# EAGLE design TinLi (EAGLE 6.2)
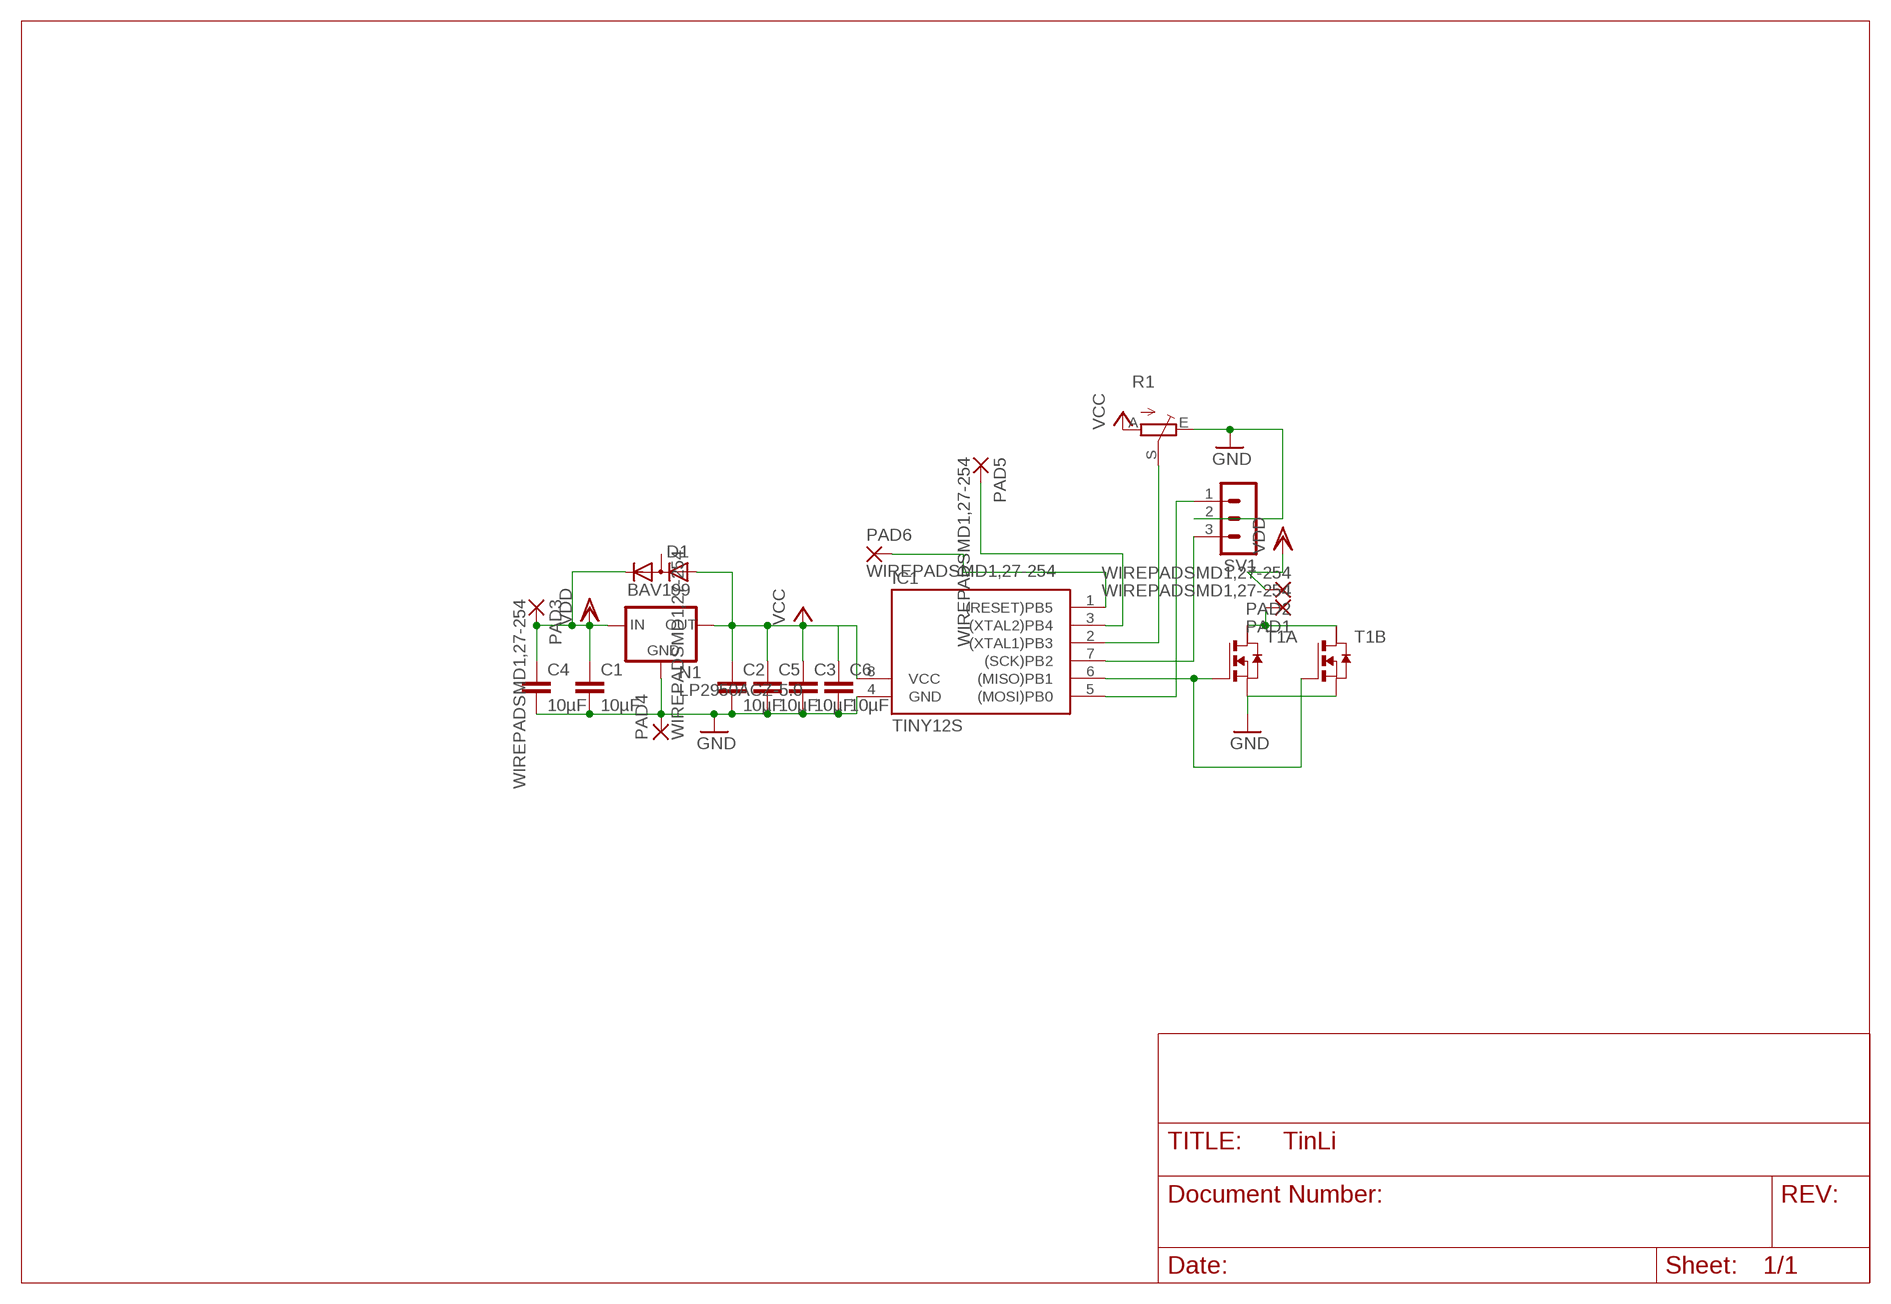
[diagram p0: schematic, sheet 1]

## Parts
C1  10µF  C-EUC1206  [C1206]
C2  10µF  C-EUC1206  [C1206]
C3  10µF  C-EUC1206  [C1206]
C4  10µF  C-EUC1206  [C1206]
C5  10µF  C-EUC1206  [C1206]
C6  10µF  C-EUC1206  [C1206]
D1  BAV199  [SOT23]
IC1  TINY12S  [SOIC8]
N1  LP2950ACZ-5.0  [TO92]
PAD1  WIREPADSMD1,27-254  [SMD1,27-2,54]
PAD2  WIREPADSMD1,27-254  [SMD1,27-2,54]
PAD3  WIREPADSMD1,27-254  [SMD1,27-2,54]
PAD4  WIREPADSMD1,27-254  [SMD1,27-2,54]
PAD5  WIREPADSMD1,27-254  [SMD1,27-2,54]
PAD6  WIREPADSMD1,27-254  [SMD1,27-2,54]
R1  TRIM_EU-CA6V  [CA6V]
SV1  MA03-1  [MA03-1]
T1  NMOS2SO8  [SO8]

## Nets
GND: C1.2 C2.2 C3.2 C4.2 C5.2 C6.2 IC1.4(GND) N1.2(GND) PAD4.1(P) R1.E SV1.2 T1.1(A:S) T1.3(B:S)
N$1: IC1.1((RESET)PB5) PAD6.1(P)
N$2: PAD1.1(P) T1.6(B:D) T1.8(A:D)
N$3: IC1.3((XTAL2)PB4) PAD5.1(P)
N$4: IC1.6((MISO)PB1) T1.2(A:G) T1.4(B:G)
N$7: IC1.7((SCK)PB2) SV1.3
N$8: IC1.5((MOSI)PB0) SV1.1
N$9: IC1.2((XTAL1)PB3) R1.S
VCC: C2.1 C3.1 C5.1 C6.1 D1.1(A) IC1.8(VCC) N1.1(OUT) R1.A
VDD: C1.1 C4.1 D1.2(C) N1.3(IN) PAD2.1(P) PAD3.1(P)
Unconnected: D1.3(AC) T1.5(B:D2) T1.7(A:D2)

## Library data of the parts
C1-C6 = rcl:C-EU: CAPACITOR, European symbol
D1 = diode:BAV199: DIODE low-leakage double diode
IC1 = atmel:TINY12*: MICROCONTROLLER 1 Kbytes FLASH 64 bytes EEPROM; OC_FARNELL: unknown; OC_NEWARK: unknown
N1 = v-reg:LP2950?*: Source: http://cache.national.com/ds/LP/LP2950.pdf
PAD1-PAD6 = wirepad:WIREPAD: Wire PAD connect wire on PCB
R1 = pot:TRIM_EU-: POTENTIOMETER
SV1 = con-lstb:MA03-1: PIN HEADER; OC_FARNELL: unknown; OC_NEWARK: unknown
T1 = zetex:NMOS2: Dual MOS FET; OC_FARNELL: unknown; OC_NEWARK: unknown

## Board
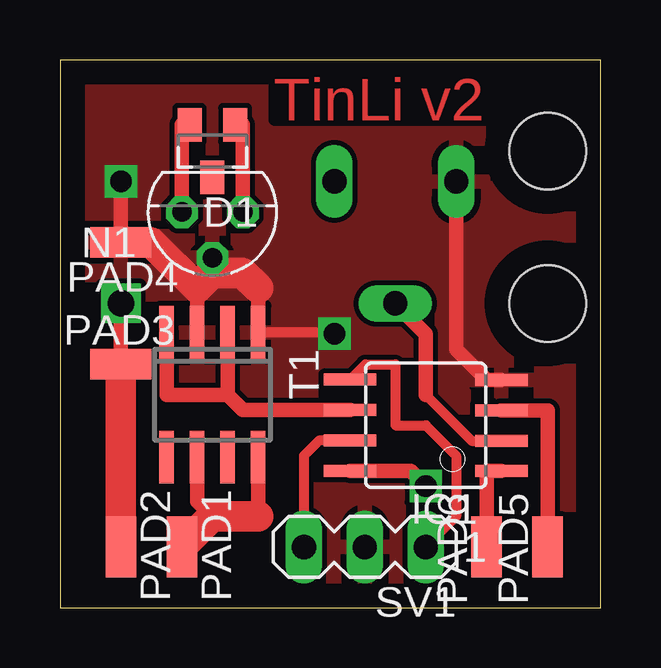
[diagram p1: board, top side]
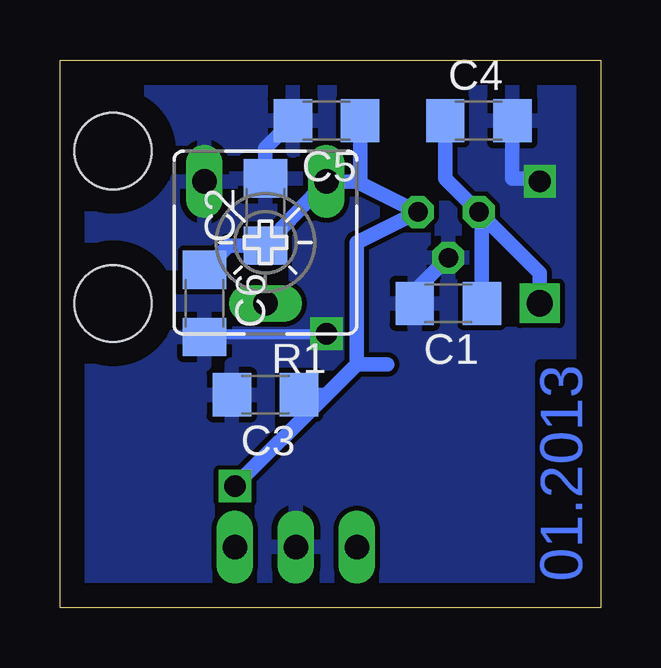
[diagram p2: board, bottom side, seen from below]

Size 22.53 x 22.85 mm. Coordinates in mm from the lower left corner, seen from the top.
Outline: 0,0 22.53,0 22.53,22.85 0,22.85 0,0
Copper layers (1*16): Top 0.035mm / dielectric 1.5mm / Bottom 0.035mm
Design rules: minimum track width 10mil, minimum drill 24mil, track to track 8mil, track to pad 8mil, pad to pad 8mil, via to via 8mil, smd to smd 8mil, copper to edge 40mil, drill to drill 8mil, minimum pad ring 10mil, minimum via ring 8mil, stop-mask expansion 4mil, vias tented up to drill 0mil, thermal gap 10mil
Holes 3.2 mm at 20.32,19.05 20.32,12.7

### Footprints (pad centres in the part's own frame; a part is rotated, then mirrored left to right if it is on the bottom)
C1206 = smd 1.6 x 1.8: 1 -1.4,0; 2 1.4,0
SOT23 = smd 1 x 1.4: 1 -0.95,-1.1; 2 0.95,-1.1; 3 0,1.1
SOIC8 = smd 0.5 x 2.2: 1 -1.905,-3.154; 2 -0.645,-3.154; 3 0.625,-3.154; 4 1.895,-3.154; 5 1.905,3.154; 6 0.635,3.154; 7 -0.635,3.154; 8 -1.905,3.154
TO92 = drill 0.813 octagon: 1 -1.27,0; 2 0,1.905; 3 1.27,0
SMD1,27-2,54 = smd 1.27 x 2.54: 1 0,0
CA6V = drill 1.016 long: A -2.54,-2.54; E 2.54,-2.54; S 0,2.54
MA03-1 = drill 1.016 long: 1 -2.54,0; 2 0,0; 3 2.54,0
SO8 = smd 0.6 x 2.2: 1 -1.905,-2.6; 2 -0.635,-2.6; 3 0.635,-2.6; 4 1.905,-2.6; 5 1.905,2.6; 6 0.635,2.6; 7 -0.635,2.6; 8 -1.905,2.6

### Placement (x,y rotation side)
C1  6.35,12.7 180 bottom
C2  13.97,16.51 90 bottom
C3  13.97,8.89 180 bottom
C4  5.08,20.32 0 bottom
C5  11.43,20.32 180 bottom
C6  16.51,12.7 270 bottom
D1  6.35,19.05 180 top
IC1  15.24,7.62 90 top
N1  6.35,16.51 180 top
PAD1  5.08,2.54 180 top
PAD2  2.54,2.54 180 top
PAD3  2.54,10.16 270 top
PAD4  2.54,15.24 90 top
PAD5  20.32,2.54 0 top
PAD6  17.78,2.54 0 top
R1  13.97,15.24 180 bottom
SV1  12.7,2.54 180 top
T1  6.35,8.89 180 top

### Tracks (layer width: path | path; a pad name or v marks a point on that pad's centre or on a via)
GND  (via drill 0.9)
  Top 0.406: v11.43,11.43 11.37,11.49 T1.1
  Top 0.61: IC1.4 17.78,9.52 16.51,10.79 R1.E | T1.3 5.71,13.34 | 8.26,13.34 T1.1 | v2.54,17.78 PAD4.1
  Top 1.27: PAD4.1 3.81,15.24 5.71,13.34 6.35,13.97 | 6.35,13.97 N1.2 | 8.26,13.34 7.62,13.97 6.35,13.97
  Bottom 0.406: C6.2 16.38,11.43 v11.43,11.43
  Bottom 0.61: C1.2 7.75,13.21 N1.2 | C4.2 3.68,17.91 2.67,17.91 v2.54,17.78 | C5.2 13.97,19.18 C2.2
  pour Top: 1.27,21.59 21.59,21.59 21.59,1.27 1.27,1.27
  pour Bottom: 1.27,21.59 21.59,21.59 21.59,1.27 1.27,1.27
N$1
  Top 0.61: IC1.1 17.78,5.71 PAD6.1
N$2
  Top 0.61: T1.6 5.71,4.45 6.35,3.81 | T1.8 8.26,3.81
  Top 1.27: PAD1.1 6.35,3.81 8.26,3.81
N$3
  Top 0.61: PAD5.1 20.32,8.24 IC1.3
N$4
  Top 0.61: T1.2 6.99,8.89 | 6.99,8.89 4.45,8.89 T1.4 | 6.99,8.89 7.62,8.26 IC1.6
N$7
  Top 0.406: IC1.7 10.79,6.99 10.16,6.35 SV1.3
N$8
  Top 0.406: IC1.5 12.72,10.16 13.97,10.16 13.97,7.62 15.24,7.62 16.51,6.35 16.51,3.81 SV1.1
N$9
  Top 0.406: 15.24,8.89 17.16,6.97 IC1.2
  Top 0.61: R1.S 15.24,11.43 15.24,8.89
VCC  (via drill 0.9)
  Top 0.61: IC1.8 14.61,5.71 v15.24,5.08 | D1.1 7.62,20.15 N1.1
  Bottom 0.61: 10.16,17.78 N1.1 10.16,15.24 10.16,10.16 | 10.16,17.78 R1.A C2.1 15.5,15.11 C6.1 | v15.24,5.08 11.43,8.89 | 11.43,8.89 10.16,10.16 | 10.16,10.16 8.89,10.16 | C5.1 10.03,17.78 10.16,17.78 | C3.1 11.43,8.89
VDD  (via drill 1.1)
  Top 0.61: PAD3.1 v2.54,12.7 | D1.2 5.08,20.15 N1.3
  Top 1.27: PAD3.1 PAD2.1
  Bottom 0.61: C1.1 4.95,16.38 N1.3 | v2.54,12.7 2.54,13.97 N1.3 | C4.1 6.48,17.91 N1.3

### Text on the board
Top: TinLi v2
Bottom: 01.2013